# Altium schematic sheet Power.SchDoc
size A
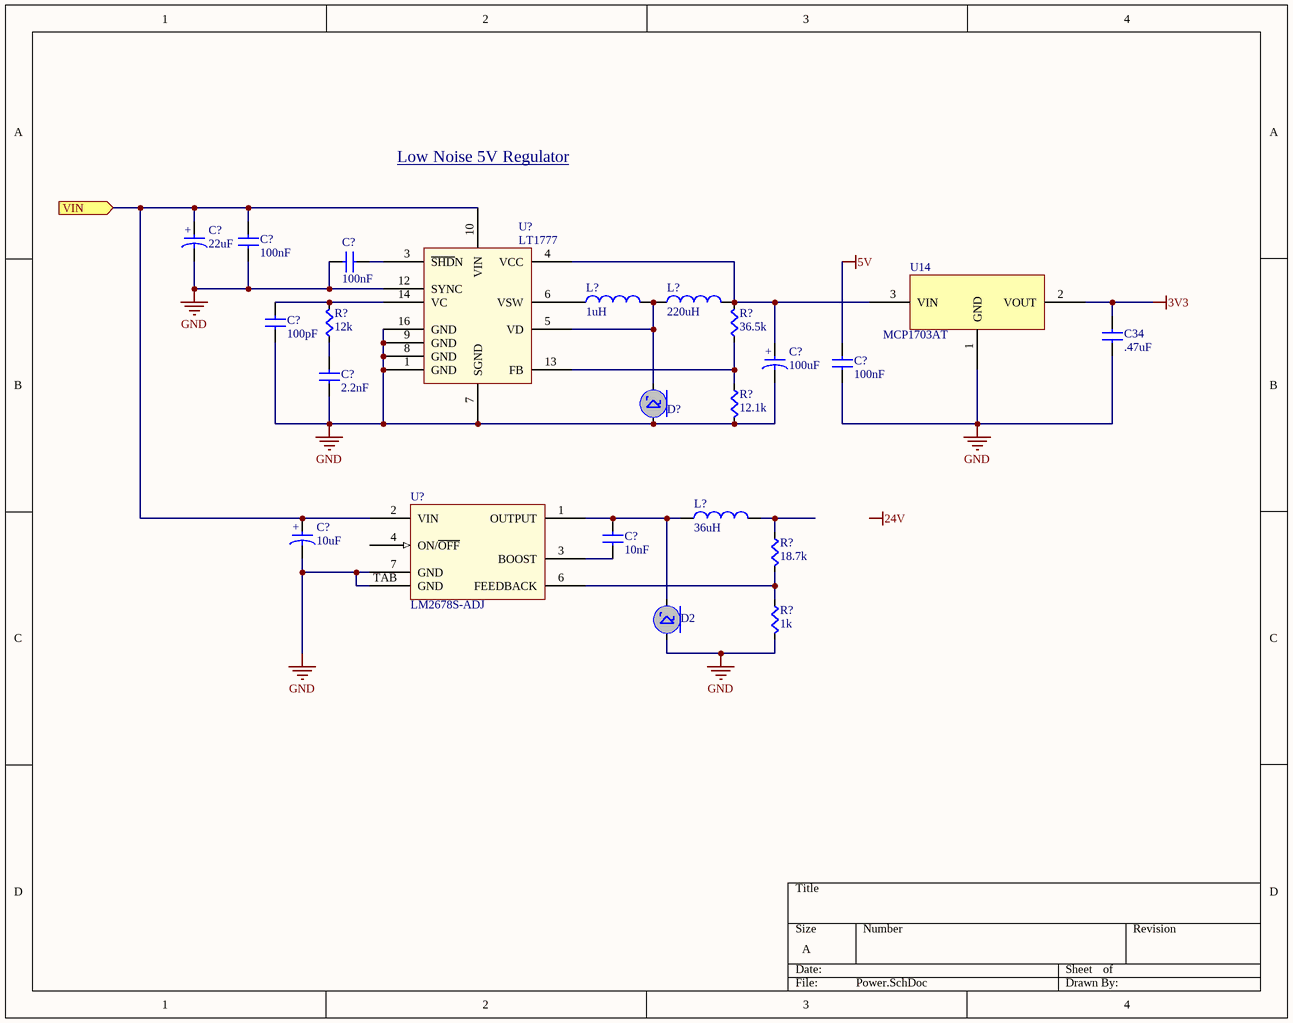
[diagram p0: Power.SchDoc]

## Parts
(Parts that share a designator on the sheet are numbered #1, #2 ... from top to bottom, then left to right.)
C34  value .47uF  [CAPC0603]  (hidden comment: Cap)
C?#1  value 22uF  [CAPP0603]  (hidden comment: CapPol)
C?#2  value 100nF  [CAPC0603]  (hidden comment: Cap)
C?#3  value 100nF  [CAPC0603]  (hidden comment: Cap)
C?#4  value 100pF  [CAPC0603]  (hidden comment: Cap)
C?#5  value 100uF  [CAPP0603]  (hidden comment: CapPol)
C?#6  value 100nF  [CAPC0603]  (hidden comment: Cap)
C?#7  value 2.2nF  [CAPC0603]  (hidden comment: Cap)
C?#8  value 10uF  [CAPP0603]  (hidden comment: CapPol)
C?#9  value 10nF  [CAPC0603]  (hidden comment: Cap)
D2  DFLS160  [POWERDI123]  (value not drawn)
D?  Schottky  [1N5819HW-7-F]  (value not drawn)
L?#1  Inductance: 1uH  [SLF7045]  (hidden comment: Inductor)
L?#2  Inductance: 220uH  [SLF7045]  (hidden comment: Inductor)
L?#3  Inductance: 36uH  [SLF7045]  (hidden comment: Inductor)
R?#1  value 12k  [RES0603]  (hidden comment: Res)
R?#2  value 36.5k  [RES0603]  (hidden comment: Res)
R?#3  value 12.1k  [RES0603]  (hidden comment: Res)
R?#4  value 18.7k  [RES0603]  (hidden comment: Res)
R?#5  value 1k  [RES0603]  (hidden comment: Res)
U14  MCP1703AT  [MCP1703AT-xx02EMB]
U?#1  LT1777
U?#2  LM2678S-ADJ  [LM2678S]

## Ports
VIN (in)

## Nets
3V3: C34.1(A) U14.2(VOUT)
5V: C?#6.1(A)
GND: C34.2(B) C?#1.2(B) C?#2.2(B) C?#3.1(A) C?#4.1(A) C?#5.2(B) C?#6.2(B) C?#7.1(A) C?#8.2(B) D2.A D?.A R?#3.1(A) R?#5.1(A) U14.1(GND) U?#1.1(GND) U?#1.7(SGND) U?#1.8(GND) U?#1.9(GND) U?#1.12(SYNC) U?#1.16(GND) U?#2.7(GND) U?#2.TAB(GND)
VIN: C?#1.1(A) C?#2.1(A) C?#8.1(A) U?#1.10(VIN) U?#2.2(VIN) ; port VIN
NetC?#3_2: C?#3.2(B) U?#1.3(~{SHD}N)
NetC?#4_2: C?#4.2(B) R?#1.1(A) U?#1.14(VC)
NetC?#5_1: C?#5.1(A) L?#2.2(B) R?#2.1(A) U14.3(VIN) U?#1.4(VCC)
NetC?#7_2: C?#7.2(B) R?#1.2(B)
NetC?#9_1: C?#9.1(A) D2.C L?#3.1(A) U?#2.1(OUTPUT)
NetC?#9_2: C?#9.2(B) U?#2.3(BOOST)
NetD?_C: D?.C L?#1.2(B) L?#2.1(A) U?#1.5(VD)
NetL?#1_1: L?#1.1(A) U?#1.6(VSW)
NetL?#3_2: L?#3.2(B) R?#4.2(B)
NetR?#2_2: R?#2.2(B) R?#3.2(B) U?#1.13(FB)
NetR?#4_1: R?#4.1(A) R?#5.2(B) U?#2.6(FEEDBACK)

Not connected (* = marked no-connect by the designer): U?#2 4(ON/~{OFF})

## Notes on the sheet
- Low Noise 5V Regulator
- Labels drawn without touching a wire or pin: 24V
- (in symbol CapPol) +

## Library data of the parts
D2 = DFLS160: 1.0A Surface Mount Schottky Barrier Rectifier; Supplier 1: Digi-Key; Supplier Part Number 1: DFLS160DICT-ND
D? = Schottky: Schottky Diode Template
U14 = MCP1703AT: 250 mA, 16V, Low Quiescent Current LDO Regulator; Supplier 1: Digi-Key; Supplier Part Number 1: MCP1703AT-3302E/MBTR-ND
U?#1 = LT1777: Low Noise Step-Down Switching Regulator; Supplier 1: Digi-Key; Supplier Part Number 1: LT1777CS#PBF-ND
U?#2 = LM2678S: Simple Switcher High Efficiency 5A Step-Down Voltage Regulator; Supplier 1: Digi-Key; Supplier Part Number 1: LM2678SX-ADJ/NOPBCT-ND
C34 C?#2-C?#4 C?#6 C?#7 C?#9 = Cap: Supplier 1: Digi-Key
  C34: Supplier Part Number 1: 445-7465-1-ND
  C?#2-C?#4 C?#6 C?#7: Supplier Part Number 1: 1276-1000-1-ND
  C?#9: Supplier Part Number 1: 1276-1009-1-ND
C?#1 C?#5 C?#8 = CapPol: Supplier 1: Digi-Key
  C?#1: Supplier Part Number 1: C1608JB0G226M080AA
  C?#5 C?#8: Supplier Part Number 1: 493-2880-1-ND
L?#1-L?#3 = Inductor
  L?#3: Supplier 1: Digi-Key; Supplier Part Number 1: 553-1129-ND
R?#1-R?#5 = Res: Supplier 1: Digi-Key
  R?#1: Supplier Part Number 1: RMCF0603JT12K0CT-ND
  R?#2: Supplier Part Number 1: RMCF0603FT36K5
  R?#3: Supplier Part Number 1: RMCF0603FT12K1CT-ND
  R?#4: Supplier Part Number 1: RMCF0603FT18R7CT-ND
  R?#5: Supplier Part Number 1: RMCF0603FT1K00CT-ND